# EAGLE design gal-psg-2 (EAGLE 6.3)
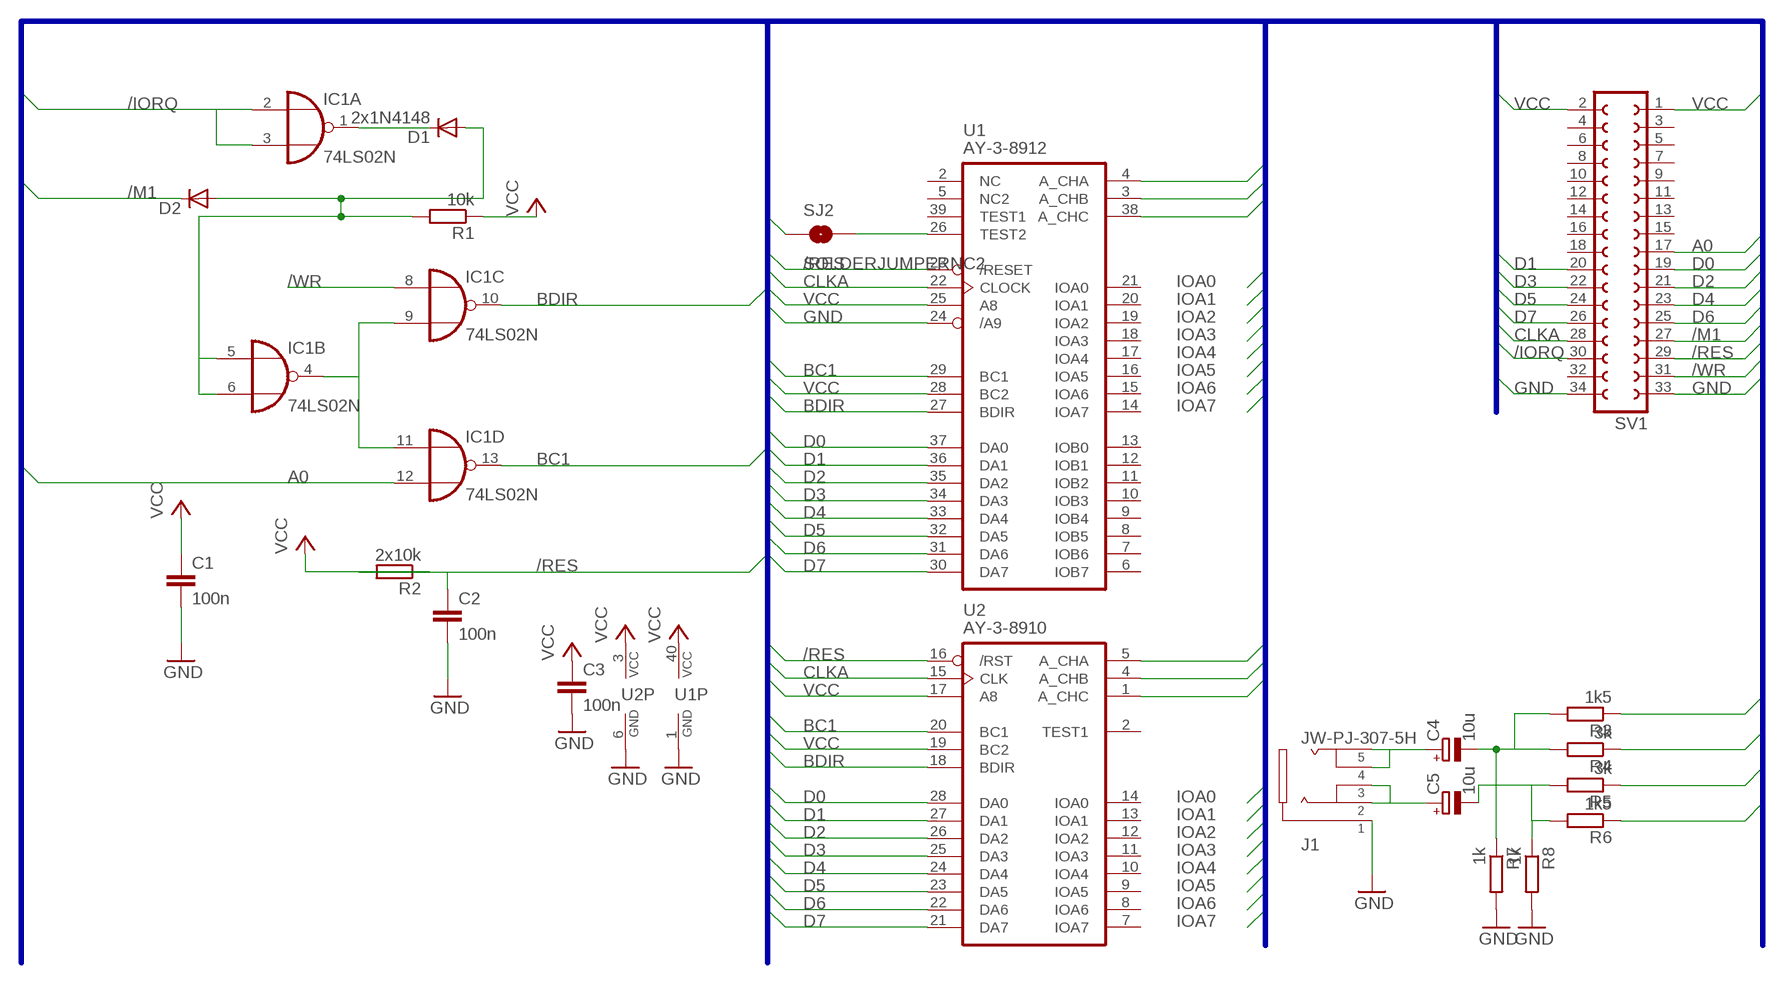
[diagram p0: schematic, sheet 1]

## Parts
C1  100n  C-EU025-024X044  [C025-024X044]
C2  100n  C-EU025-024X044  [C025-024X044]
C3  100n  C-EU025-024X044  [C025-024X044]
C4  10u  CPOL-EUE1.8-4  [E1,8-4]
C5  10u  CPOL-EUE1.8-4  [E1,8-4]
D1  2x1N4148  DIODE-D-2.5  [D-2.5]
D2  DIODE-D-2.5  [D-2.5]
IC1  74LS02N  [DIL14]
J1  JW-PJ-307-5H  [JW-PJ-307-5H]
R1  10k  R-EU_0207/2V  [0207/2V]
R2  2x10k  R-EU_0207/2V  [0207/2V]
R3  1k5  R-EU_0207/2V  [0207/2V]
R4  3k  R-EU_0207/2V  [0207/2V]
R5  3k  R-EU_0207/2V  [0207/2V]
R6  1k5  R-EU_0207/2V  [0207/2V]
R7  1k  R-EU_0207/2V  [0207/2V]
R8  1k  R-EU_0207/2V  [0207/2V]
SJ2  SOLDERJUMPERNC2  [SJ_2S-NOTRACE]
SV1  FE17-2W  [FE17-2W]
U1  AY-3-8912  [DIL40]
U2  AY-3-8910  [DIL28-6]

## Nets
/IORQ: IC1.2(A:I0) IC1.3(A:I1) SV1.30
/M1: D2.C SV1.27
/RES: C2.1 R2.2 SV1.29 U1.23(/RESET) U2.16(/RST)
/WR: IC1.8(C:I0) SV1.31
A: R3.1 U1.4(A_CHA) U2.5(A_CHA)
A0: IC1.12(D:I1) SV1.17
B: R4.1 R5.1 U1.3(A_CHB) U2.4(A_CHB)
BC1: IC1.13(D:O) U1.29(BC1) U2.20(BC1)
BDIR: IC1.10(C:O) U1.27(BDIR) U2.18(BDIR)
C: R6.1 U1.38(A_CHC) U2.1(A_CHC)
CLKA: SV1.28 U1.22(CLOCK) U2.15(CLK)
D0: SV1.19 U1.37(DA0) U2.28(DA0)
D1: SV1.20 U1.36(DA1) U2.27(DA1)
D2: SV1.21 U1.35(DA2) U2.26(DA2)
D3: SV1.22 U1.34(DA3) U2.25(DA3)
D4: SV1.23 U1.33(DA4) U2.24(DA4)
D5: SV1.24 U1.32(DA5) U2.23(DA5)
D6: SV1.25 U1.31(DA6) U2.22(DA6)
D7: SV1.26 U1.30(DA7) U2.21(DA7)
GND: C1.2 C2.2 C3.2 J1.1 R7.2 R8.2 SJ2.1 SV1.33 SV1.34 U1.1(GND) U1.24(/A9) U2.6(GND)
N$1: SJ2.2 U1.26(TEST2)
N$2: D1.C IC1.1(A:O)
N$4: C5.+ J1.2 J1.3
N$5: D1.A D2.A IC1.5(B:I0) IC1.6(B:I1) R1.2
N$6: C4.- R3.2 R4.2 R7.1
N$7: IC1.4(B:O) IC1.9(C:I1) IC1.11(D:I0)
N$8: C4.+ J1.4 J1.5
N$9: C5.- R5.2 R6.2 R8.1
VCC: C1.1 C3.1 R1.1 R2.1 SV1.1 SV1.2 U1.25(A8) U1.28(BC2) U1.40(VCC) U2.3(VCC) U2.17(A8) U2.19(BC2)
Unconnected: SV1.3 SV1.4 SV1.5 SV1.6 SV1.7 SV1.8 SV1.9 SV1.10 SV1.11 SV1.12 SV1.13 SV1.14 SV1.15 SV1.16 SV1.18 SV1.32 U1.2(NC) U1.5(NC2) U1.6(IOB7) U1.7(IOB6) U1.8(IOB5) U1.9(IOB4) U1.10(IOB3) U1.11(IOB2) U1.12(IOB1) U1.13(IOB0) U1.14(IOA7) U1.15(IOA6) U1.16(IOA5) U1.17(IOA4) U1.18(IOA3) U1.19(IOA2) U1.20(IOA1) U1.21(IOA0) U1.39(TEST1) U2.2(TEST1) U2.7(IOA7) U2.8(IOA6) U2.9(IOA5) U2.10(IOA4) U2.11(IOA3) U2.12(IOA2) U2.13(IOA1) U2.14(IOA0)

## Buses
D[0..7],BDIR,BC1,/RES,CLKA,IOA[0..7],VCC,GND,A,B,C,/IORQ,/M1,/WR,A0,A,B,C

## Power pins joined to a net without a drawn wire
GND: IC1.7(P:GND)
VCC: IC1.14(P:VCC)

## Library data of the parts
C1-C3 = rcl:C-EU: CAPACITOR, European symbol
C4 C5 = rcl:CPOL-EU: POLARIZED CAPACITOR, European symbol
D1 D2 = diode:DIODE-: DIODE
IC1 = 74xx-eu:74*02: Quad 2-input NOR gate
J1 = audiojacks:JW-PJ-307-5
R1-R8 = rcl:R-EU_: RESISTOR, European symbol
SJ2 = SparkFun-Passives:SOLDERJUMPER: Solder Jumper Standard SMD solder jumper. Used to automate production. Two varients : Normally Open and Normally Closed are the same, but have different paste layers. NC will have a large amount of paste and should jumper during reflow.
SV1 = con-lsta:FE17-2W: FEMALE HEADER; OC_FARNELL: unknown; OC_NEWARK: unknown
U1 = oldchips:AY-3-8912: Programmable sound generator
U2 = oldchips:AY-3-8910: Programmable sound generator

## Board
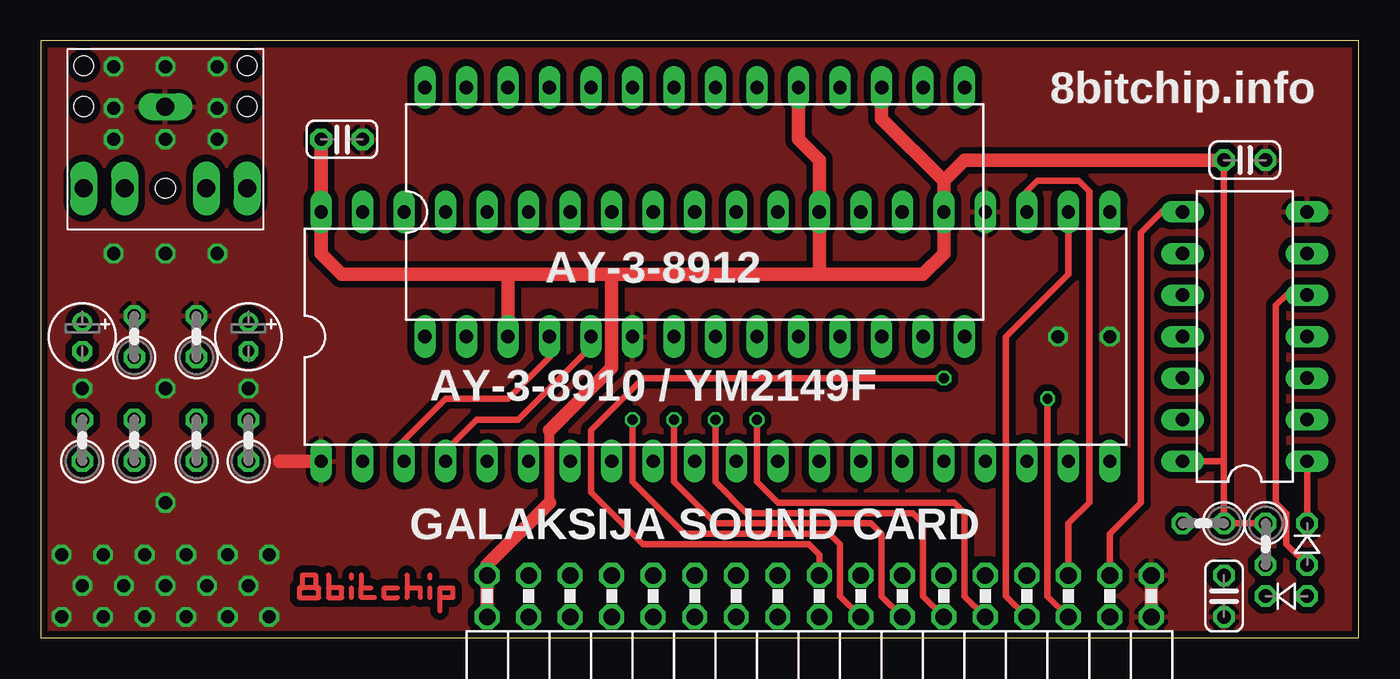
[diagram p1: board, top side]
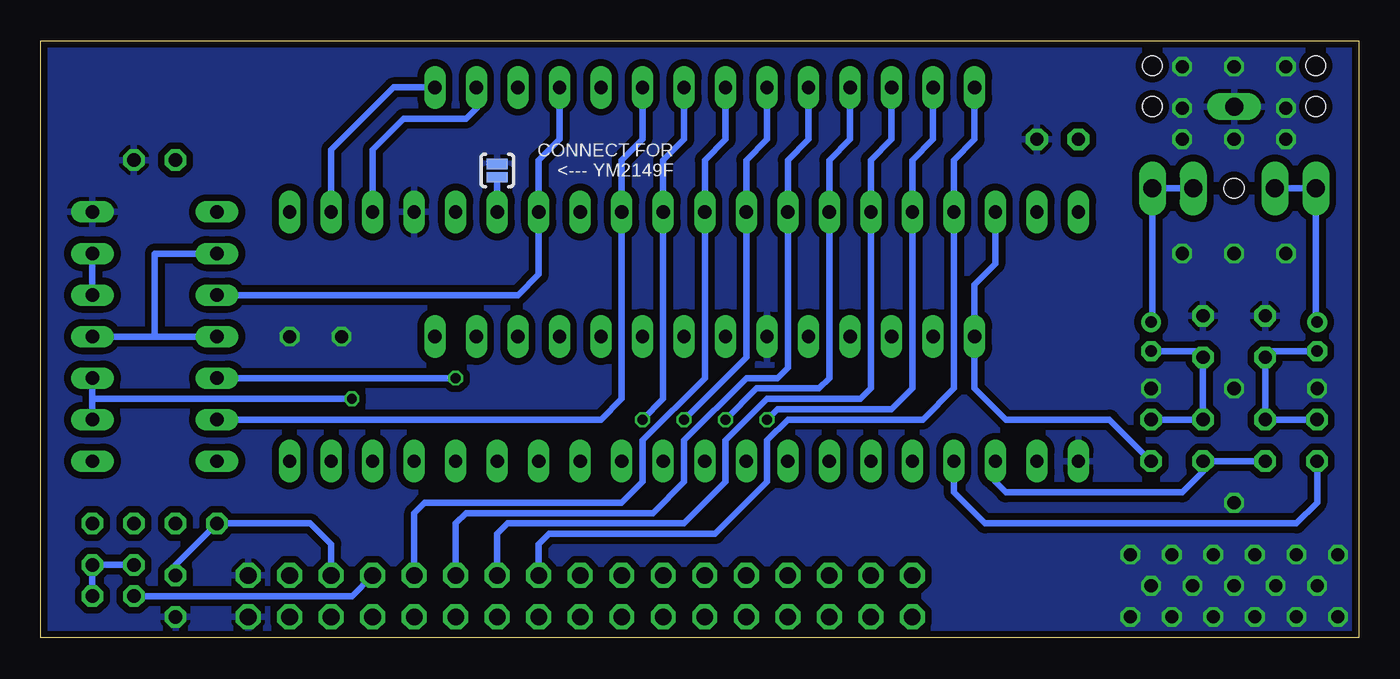
[diagram p2: board, bottom side, seen from below]

Size 80.62 x 36.5 mm. Coordinates in mm from the lower left corner, seen from the top.
Outline: 0,0 80.62,0 80.62,36.5 0,36.5 0,0
Copper layers (1*16): Top 0.035mm / dielectric 1.5mm / Bottom 0.035mm
Design rules "dirt_cheap_dirty_boards.v1": minimum track width 5mil, minimum drill 12mil, track to track 5mil, track to pad 5mil, pad to pad 5mil, via to via 5mil, smd to smd 0mil, copper to edge 10mil, drill to drill 10mil, minimum pad ring 10mil, minimum via ring 6mil, stop-mask expansion 2mil, vias tented up to drill 25mil, thermal gap 10mil

### Footprints (pad centres in the part's own frame; a part is rotated, then mirrored left to right if it is on the bottom)
C025-024X044 = drill 0.813 octagon: 1 -1.27,0; 2 1.27,0
E1,8-4 = drill 0.711 pad 1.168: + -0.889,0 | drill 0.711 pad 1.168 octagon: - 0.889,0
D-2.5 = drill 0.813 octagon: A 1.27,0; C -1.27,0
DIL14 = drill 0.813 long: 1 -7.62,-3.81; 2 -5.08,-3.81; 3 -2.54,-3.81; 4 0,-3.81; 5 2.54,-3.81; 6 5.08,-3.81; 7 7.62,-3.81; 8 7.62,3.81; 9 5.08,3.81; 10 2.54,3.81; 11 0,3.81; 12 -2.54,3.81; 13 -5.08,3.81; 14 -7.62,3.81
JW-PJ-307-5H = drill 1.1 long: 1 -2,0; 2 3,5; 3 3,2.5; 4 3,-2.5; 5 3,-5 | hole 1.2: -4.5,5; -2,5; 3,0; -4.5,-5; -2,-5
0207/2V = drill 0.813 octagon: 1 -1.27,0; 2 1.27,0
SJ_2S-NOTRACE = smd 0.635 x 1.27: 1 -0.401,0; 2 0.413,0
FE17-2W = drill 1.016 octagon: 1 -20.32,1.27; 2 -20.32,-1.27; 3 -17.78,1.27; 4 -17.78,-1.27; 5 -15.24,1.27; 6 -15.24,-1.27; 7 -12.7,1.27; 8 -12.7,-1.27; 9 -10.16,1.27; 10 -10.16,-1.27; 11 -7.62,1.27; 12 -7.62,-1.27; 13 -5.08,1.27; 14 -5.08,-1.27; 15 -2.54,1.27; 16 -2.54,-1.27; 17 0,1.27; 18 0,-1.27; 19 2.54,1.27; 20 2.54,-1.27; 21 5.08,1.27; 22 5.08,-1.27; 23 7.62,1.27; 24 7.62,-1.27; 25 10.16,1.27; 26 10.16,-1.27; 27 12.7,1.27; 28 12.7,-1.27; 29 15.24,1.27; 30 15.24,-1.27; 31 17.78,1.27; 32 17.78,-1.27; 33 20.32,1.27; 34 20.32,-1.27
DIL40 = drill 0.813 long: 1 -24.13,-7.62; 2 -21.59,-7.62; 3 -19.05,-7.62; 4 -16.51,-7.62; 5 -13.97,-7.62; 6 -11.43,-7.62; 7 -8.89,-7.62; 8 -6.35,-7.62; 9 -3.81,-7.62; 10 -1.27,-7.62; 11 1.27,-7.62; 12 3.81,-7.62; 13 6.35,-7.62; 14 8.89,-7.62; 15 11.43,-7.62; 16 13.97,-7.62; 17 16.51,-7.62; 18 19.05,-7.62; 19 21.59,-7.62; 20 24.13,-7.62; 21 24.13,7.62; 22 21.59,7.62; 23 19.05,7.62; 24 16.51,7.62; 25 13.97,7.62; 26 11.43,7.62; 27 8.89,7.62; 28 6.35,7.62; 29 3.81,7.62; 30 1.27,7.62; 31 -1.27,7.62; 32 -3.81,7.62; 33 -6.35,7.62; 34 -8.89,7.62; 35 -11.43,7.62; 36 -13.97,7.62; 37 -16.51,7.62; 38 -19.05,7.62; 39 -21.59,7.62; 40 -24.13,7.62
DIL28-6 = drill 0.813 long: 1 -16.51,-7.62; 2 -13.97,-7.62; 3 -11.43,-7.62; 4 -8.89,-7.62; 5 -6.35,-7.62; 6 -3.81,-7.62; 7 -1.27,-7.62; 8 1.27,-7.62; 9 3.81,-7.62; 10 6.35,-7.62; 11 8.89,-7.62; 12 11.43,-7.62; 13 13.97,-7.62; 14 16.51,-7.62; 15 16.51,7.62; 16 13.97,7.62; 17 11.43,7.62; 18 8.89,7.62; 19 6.35,7.62; 20 3.81,7.62; 21 1.27,7.62; 22 -1.27,7.62; 23 -3.81,7.62; 24 -6.35,7.62; 25 -8.89,7.62; 26 -11.43,7.62; 27 -13.97,7.62; 28 -16.51,7.62

### Placement (x,y rotation side)
C1  73.66,29.21 0 top
C2  72.39,2.54 270 top
C3  18.41,30.48 0 top
C4  2.54,18.41 270 top
C5  12.7,18.41 270 top
D1  77.47,5.71 270 top
D2  76.2,2.54 0 top
IC1  73.66,18.41 90 top
J1  7.62,30.48 270 top
R1  74.93,5.71 270 top
R2  71.12,6.99 180 top
R3  2.54,12.06 90 top
R4  5.71,12.06 90 top
R5  9.53,12.06 90 top
R6  12.7,12.06 90 top
R7  5.71,18.41 90 top
R8  9.53,18.41 90 top
SJ2  52.7,28.57 270 bottom
SV1  47.62,2.54 0 top
U1  41.27,18.41 0 top
U2  40.01,26.04 0 top

### Tracks (layer width: path | path; a pad name or v marks a point on that pad's centre or on a via)
/IORQ  (via drill 0.6)
  Top 0.406: SV1.30 61.59,2.54 v61.59,14.61
  Bottom 0.406: IC1.3 77.47,14.61 | 77.47,14.61 IC1.2 | v61.59,14.61 77.47,14.61
/M1
  Bottom 0.406: SV1.27 61.59,2.54 D2.C
/RES
  Top 0.406: U1.23 60.33,27.3 60.96,27.94 63.5,27.94 64.14,27.3 64.14,8.26 62.87,6.99 SV1.29
  Bottom 0.406: U2.16 53.98,32.38 54.61,31.75 58.42,31.75 60.33,29.84 U1.23 | SV1.29 62.87,5.71 64.14,6.99 R2.2 72.39,4.45 C2.1
/WR
  Top 0.406: SV1.31 65.41,6.35 67.31,8.26 67.31,24.77 68.58,26.04 IC1.8
A
  Top 0.406: U2.5 33.66,17.78 29.21,13.34 26.67,13.34 24.77,11.43 U1.4
  Bottom 0.406: R3.1 2.54,8.26 3.81,6.99 22.86,6.99 24.77,8.89 U1.4
A0  (via drill 0.6)
  Top 0.406: SV1.17 47.62,5.08 46.99,5.71 36.83,5.71 33.66,8.89 33.66,12.7 36.83,15.88 v55.24,15.88
  Bottom 0.406: v55.24,15.88 IC1.12
B
  Top 0.406: U2.4 31.11,17.14 28.57,14.61 24.77,14.61 22.23,12.06 U1.3
  Bottom 0.406: R4.1 R5.1 9.53,10.16 10.79,8.89 21.59,8.89 22.23,9.53 U1.3
BC1
  Bottom 0.406: IC1.13 46.35,13.34 45.09,14.61 U1.29 45.09,29.21 43.81,30.48 U2.20
BDIR
  Bottom 0.406: IC1.10 51.44,20.95 50.16,22.23 U1.27 50.16,29.21 48.9,30.48 U2.18
C
  Bottom 0.406: U1.38 22.23,22.86 23.5,21.59 U2.1 23.5,15.24 21.59,13.34 15.24,13.34 R6.1
CLKA
  Top 0.406: SV1.28 59.05,2.54 59.05,18.41 62.87,22.23 U1.22
  Bottom 0.406: U2.15 59.05,33.66 62.87,29.84 U1.22
D0
  Bottom 0.406: U2.28 23.5,30.48 24.77,29.21 U1.37 24.77,15.24 26.67,13.34 34.92,13.34 36.2,12.06 36.2,9.53 39.37,6.35 49.53,6.35 50.16,5.71 SV1.19
D1  (via drill 0.6)
  Top 0.406: SV1.20 48.9,2.54 48.9,5.71 48.26,6.35 39.37,6.35 36.2,9.53 v36.2,13.34
  Bottom 0.406: v36.2,13.34 35.56,13.97 28.57,13.97 27.3,15.24 U1.36 27.3,29.21 26.04,30.48 U2.27
D2
  Bottom 0.406: U2.26 28.57,30.48 29.84,29.21 U1.35 29.84,15.24 30.48,14.61 36.2,14.61 38.73,12.06 38.73,9.53 41.27,6.99 52.07,6.99 52.7,6.35 SV1.21
D3  (via drill 0.6)
  Top 0.406: SV1.22 51.44,2.54 51.44,6.35 50.8,6.99 41.27,6.99 38.73,9.53 v38.73,13.34
  Bottom 0.406: v38.73,13.34 36.83,15.24 33.02,15.24 32.38,15.88 U1.34 32.38,29.21 31.11,30.48 U2.25
D4
  Bottom 0.406: U2.24 33.66,30.48 34.92,29.21 U1.33 34.92,16.51 35.56,15.88 37.47,15.88 41.27,12.06 41.27,9.53 43.18,7.62 54.61,7.62 55.24,6.99 SV1.23
D5  (via drill 0.6)
  Top 0.406: SV1.24 53.98,2.54 53.98,6.99 53.34,7.62 43.18,7.62 41.27,9.53 v41.27,13.34
  Bottom 0.406: v41.27,13.34 37.47,17.14 U1.32 37.47,29.21 36.2,30.48 U2.23
D6
  Bottom 0.406: U2.22 38.73,30.48 40.01,29.21 U1.31 40.01,15.88 43.81,12.06 43.81,9.53 45.09,8.26 57.15,8.26 57.78,7.62 SV1.25
D7  (via drill 0.6)
  Top 0.406: SV1.26 56.52,2.54 56.52,7.62 55.88,8.26 45.09,8.26 43.81,9.53 v43.81,13.34
  Bottom 0.406: v43.81,13.34 42.55,14.61 U1.30 42.55,29.21 41.27,30.48 U2.21
GND  (via drill 0.8)
  Top 0.813: SV1.34 SV1.33 | U1.1 14.61,10.79
  other vias: 6.35,5.08 1.27,5.08 3.81,5.08 8.89,5.08 11.43,5.08 13.97,5.08 12.7,3.17 13.97,1.27 11.43,1.27 8.89,1.27 6.35,1.27 3.81,1.27 1.27,1.27 10.16,3.17 7.62,3.17 5.08,3.17 2.54,3.17 2.54,15.24 7.62,15.24 12.7,15.24 4.45,23.5 7.62,23.5 10.79,23.5 7.62,30.48 4.45,32.38 4.45,34.92 7.62,34.92 10.79,34.92 10.79,32.38 10.79,30.48 4.45,30.48 7.62,8.26 62.23,18.41 65.41,18.41
  pour Bottom (isolate 0.406): -5.08,-3.81 82.55,-3.81 82.55,38.73 -5.08,38.73
  pour Top (isolate 0.406): -1.27,37.47 81.92,37.47 81.92,-1.91 -1.27,-1.91
N$1
  Bottom 0.406: U1.26 SJ2.2
N$2
  Top 0.406: IC1.1 D1.C
N$3
  Top 0.305: 16.8,3.04 17,3.04 17,2.44 15.8,2.44 15.8,3.04 16,3.04 | 16.8,3.04 16,3.04 | 16,3.04 16,3.85 16.8,3.85 16.8,3.04
N$4
  Bottom 0.406: J1.3 J1.2 12.62,19.38 C5.+
N$5
  Top 0.406: IC1.5 76.2,20.95 75.56,20.32 75.56,8.26 76.2,7.62 76.2,5.71 D1.A
  Bottom 0.406: IC1.6 IC1.5 | R1.2 D1.A D2.A
N$6
  Bottom 0.406: C4.- 5.33,17.53 R7.1 R4.2 R3.2
N$7
  Bottom 0.406: IC1.9 73.66,23.5 73.66,18.41 | 73.66,18.41 IC1.4 | IC1.11 73.66,18.41
N$8
  Bottom 0.406: J1.4 J1.5 2.62,19.38 C4.+
N$9
  Bottom 0.406: C5.- 9.91,17.53 R8.1 R5.2 R6.2
N$10
  Top 0.305: 17.61,3.85 17.61,3.04 | 17.61,3.04 17.61,2.44 18.41,2.44 18.41,3.04 17.61,3.04
N$16
  Top 0.305: 19,2.44 19,3.04
N$17
  Top 0.305: 19,3.65 19,3.85
N$18
  Top 0.305: 21.8,3.04 21,3.04 21,2.44 21.8,2.44
N$19
  Top 0.305: 22.41,3.85 22.41,3.04 | 22.41,3.04 22.41,2.44 | 22.41,3.04 23.2,3.04 23.2,2.44
N$20
  Top 0.305: 23.8,2.44 23.8,3.04
N$21
  Top 0.305: 23.8,3.65 23.8,3.85
N$22
  Top 0.305: 24.41,2.44 24.41,3.04 25.2,3.04 25.2,2.44 24.41,2.44 | 24.41,2.44 24.41,1.65
N$23
  Top 0.305: 19.61,3.85 19.61,3.04 | 20.41,2.44 19.61,2.44 19.61,3.04 | 19.61,3.04 20.2,3.04
VCC
  Top 0.406: C1.1 72.39,10.79 | 72.39,10.79 R2.1 R1.1 | IC1.14 72.39,10.79
  Top 0.61: 31.11,8.26 31.11,12.7
  Top 0.813: SV1.2 SV1.1 27.3,4.45 31.11,8.26 | C3.1 U1.40 17.14,23.5 18.41,22.23 28.57,22.23 | 28.57,22.23 34.92,22.23 | 34.92,22.23 47.62,22.23 | 47.62,22.23 U1.28 47.62,29.21 46.35,30.48 U2.19 | 47.62,22.23 53.98,22.23 55.24,23.5 U1.25 55.24,27.94 | U2.3 28.57,22.23 | 31.11,12.7 34.92,16.51 34.92,22.23 | U2.17 51.44,31.75 55.24,27.94 | C1.1 56.52,29.21 55.24,27.94

### Text on the board
tNames: 8bitchip.info | AY-3-8912 / / / AY-3-8910 / YM2149F | GALAKSIJA SOUND CARD
bNames: CONNECT FOR / <--- YM2149F